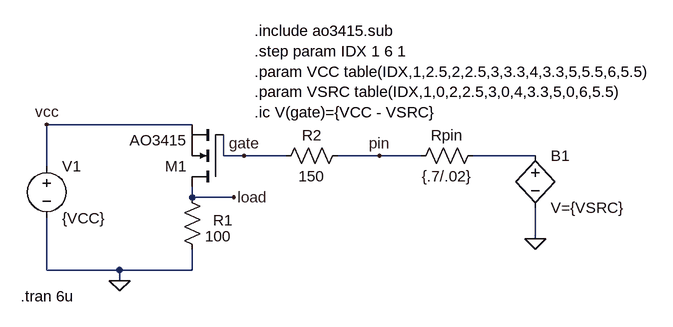
[diagram p0: schematic attiny pin mosfet sim.asc]
attiny pin mosfet sim.asc, the LTspice schematic file:
Version 4
SHEET 1 1052 680
WIRE 224 80 0 80
WIRE 272 128 272 96
WIRE 304 128 272 128
WIRE 368 128 304 128
WIRE 512 128 448 128
WIRE 576 128 512 128
WIRE 752 128 656 128
WIRE 0 144 0 80
WIRE 224 192 224 176
WIRE 288 192 224 192
WIRE 752 256 752 208
WIRE 0 304 0 224
WIRE 112 304 0 304
WIRE 224 304 224 272
WIRE 224 304 112 304
WIRE 112 320 112 304
FLAG 112 320 0
FLAG 0 80 vcc
FLAG 288 192 load
FLAG 304 128 gate
FLAG 512 128 pin
FLAG 752 256 0
SYMBOL voltage 0 128 R0
WINDOW 123 0 0 Left 0
WINDOW 39 0 0 Left 0
SYMATTR InstName V1
SYMATTR Value {VCC}
SYMBOL res 208 176 R0
WINDOW 0 48 51 Left 2
SYMATTR InstName R1
SYMATTR Value 100
SYMBOL nmos 272 176 R180
SYMATTR InstName M1
SYMATTR Value AO3415
SYMATTR Prefix X
SYMBOL res 352 144 R270
WINDOW 0 32 56 VTop 2
WINDOW 3 0 56 VBottom 2
SYMATTR InstName R2
SYMATTR Value 150
SYMBOL bv 752 112 R0
SYMATTR InstName B1
SYMATTR Value V={VSRC}
SYMBOL res 672 112 R90
WINDOW 0 0 56 VBottom 2
WINDOW 3 32 56 VTop 2
SYMATTR InstName Rpin
SYMATTR Value {.7/.02}
TEXT -40 344 Left 2 !.tran 6u
TEXT 320 -64 Left 2 !.include ao3415.sub\n.step param IDX 1 6 1\n.param VCC table(IDX,1,2.5,2,2.5,3,3.3,4,3.3,5,5.5,6,5.5)\n.param VSRC table(IDX,1,0,2,2.5,3,0,4,3.3,5,0,6,5.5)\n.ic V(gate)={VCC - VSRC}

The netlist it stands for:
* attiny pin mosfet sim.asc
V1 vcc 0 {VCC}
R1 load 0 100
XM1 load gate vcc AO3415  ; pins D G S
R2 gate pin 150
B1 N001 0 V={VSRC}
Rpin N001 pin {.7/.02}
.tran 6u
.include ao3415.sub
.step param IDX 1 6 1
.param VCC table(IDX,1,2.5,2,2.5,3,3.3,4,3.3,5,5.5,6,5.5)
.param VSRC table(IDX,1,0,2,2.5,3,0,4,3.3,5,0,6,5.5)
.ic V(gate)={VCC - VSRC}
.backanno
.end